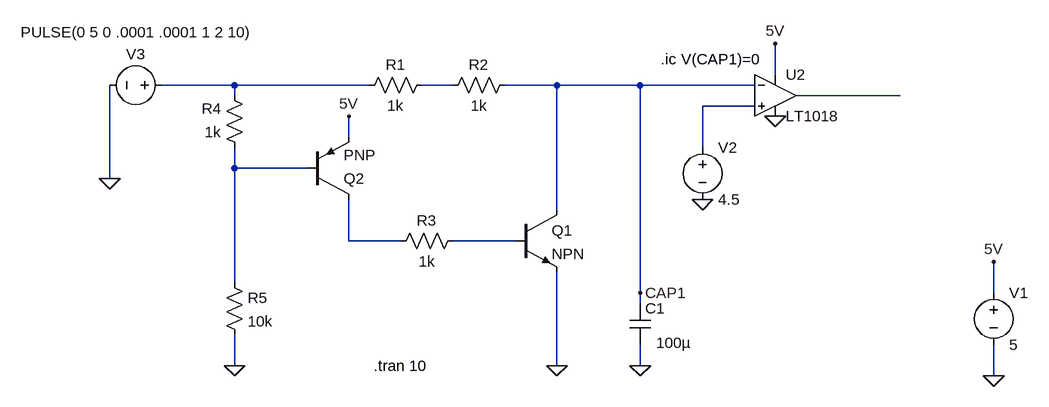
[diagram p0: schematic .5SecAutoResetTimer.asc]
.5SecAutoResetTimer.asc, the LTspice schematic file:
Version 4
SHEET 1 936 680
WIRE 544 -416 544 -464
WIRE -288 -400 -400 -400
WIRE -80 -400 -288 -400
WIRE 48 -400 0 -400
WIRE 208 -400 128 -400
WIRE 336 -400 208 -400
WIRE 512 -400 336 -400
WIRE -288 -384 -288 -400
WIRE 736 -384 576 -384
WIRE 512 -368 432 -368
WIRE -112 -320 -112 -352
WIRE 432 -304 432 -368
WIRE -288 -272 -288 -304
WIRE -176 -272 -288 -272
WIRE -480 -256 -480 -400
WIRE 208 -208 208 -400
WIRE -112 -160 -112 -224
WIRE -32 -160 -112 -160
WIRE 144 -160 48 -160
WIRE -288 -96 -288 -272
WIRE 336 -80 336 -400
WIRE 880 -80 880 -128
WIRE 336 -64 336 -80
WIRE -288 32 -288 -16
WIRE 208 32 208 -112
WIRE 336 32 336 0
WIRE 880 48 880 0
FLAG 336 32 0
FLAG 880 48 0
FLAG 432 -224 0
FLAG 544 -352 0
FLAG 336 -80 CAP1
FLAG 208 32 0
FLAG -288 32 0
FLAG 544 -464 5V
FLAG 880 -128 5V
FLAG -480 -256 0
FLAG -112 -352 5V
SYMBOL res 16 -416 R90
WINDOW 0 0 56 VBottom 2
WINDOW 3 32 56 VTop 2
SYMATTR InstName R1
SYMATTR Value 1k
SYMATTR SpiceLine tol=5 pwr=.1
SYMBOL res 144 -416 R90
WINDOW 0 0 56 VBottom 2
WINDOW 3 32 56 VTop 2
SYMATTR InstName R2
SYMATTR Value 1k
SYMATTR SpiceLine tol=5 pwr=.1
SYMBOL cap 320 -64 R0
WINDOW 3 41 61 Left 2
SYMATTR InstName C1
SYMATTR Value 100µ
SYMATTR SpiceLine V=6.4
SYMBOL voltage 880 -96 R0
WINDOW 123 0 0 Left 0
WINDOW 39 0 0 Left 0
SYMATTR InstName V1
SYMATTR Value 5
SYMBOL voltage 432 -320 R0
WINDOW 123 0 0 Left 0
WINDOW 39 0 0 Left 0
SYMATTR InstName V2
SYMATTR Value 4.5
SYMBOL Comparators\\LT1018 544 -384 R0
SYMATTR InstName U2
SYMBOL npn 144 -208 R0
SYMATTR InstName Q1
SYMBOL pnp -176 -224 M180
SYMATTR InstName Q2
SYMBOL res 64 -176 R90
WINDOW 0 0 56 VBottom 2
WINDOW 3 32 56 VTop 2
SYMATTR InstName R3
SYMATTR Value 1k
SYMBOL res -304 -112 R0
SYMATTR InstName R5
SYMATTR Value 10k
SYMBOL voltage -384 -400 R90
WINDOW 0 -32 56 VBottom 2
WINDOW 3 -66 54 VBottom 2
WINDOW 123 0 0 Left 0
WINDOW 39 0 0 Left 0
SYMATTR InstName V3
SYMATTR Value PULSE(0 5 0 .0001 .0001 1 2 10)
SYMBOL res -272 -288 R180
WINDOW 0 36 76 Left 2
WINDOW 3 36 40 Left 2
SYMATTR InstName R4
SYMATTR Value 1k
TEXT -74 32 Left 2 !.tran 10
TEXT 368 -440 Left 2 !.ic V(CAP1)=0

The netlist it stands for:
* .5SecAutoResetTimer.asc
R1 N002 N001 1k tol=5 pwr=.1
R2 CAP1 N002 1k tol=5 pwr=.1
C1 CAP1 0 100µ V=6.4
V1 5V 0 5
V2 N004 0 4.5
XU2 N004 CAP1 5V 0 N003 LT1018  ; pins In+ In- V+ V- OUT
Q1 CAP1 N007 0 0 NPN
Q2 N006 N005 5V 0 PNP
R3 N007 N006 1k
R5 N005 0 10k
V3 N001 0 PULSE(0 5 0 .0001 .0001 1 2 10)
R4 N005 N001 1k
.model NPN NPN
.model PNP PNP
.lib standard.bjt
.tran 10
.ic V(CAP1)=0
.lib LTC1.lib
.backanno
.end